# Altium schematic sheet FPGA Config_Power.SchDoc: =ProjectTitle
size A3; Author: Jaime I. Chait; Organization: NWES LLC; Address1: 111 SW 5th Ave, STE 3150; Address2: Portland, OR 97204; SheetNumber: 13; SheetTotal: 19
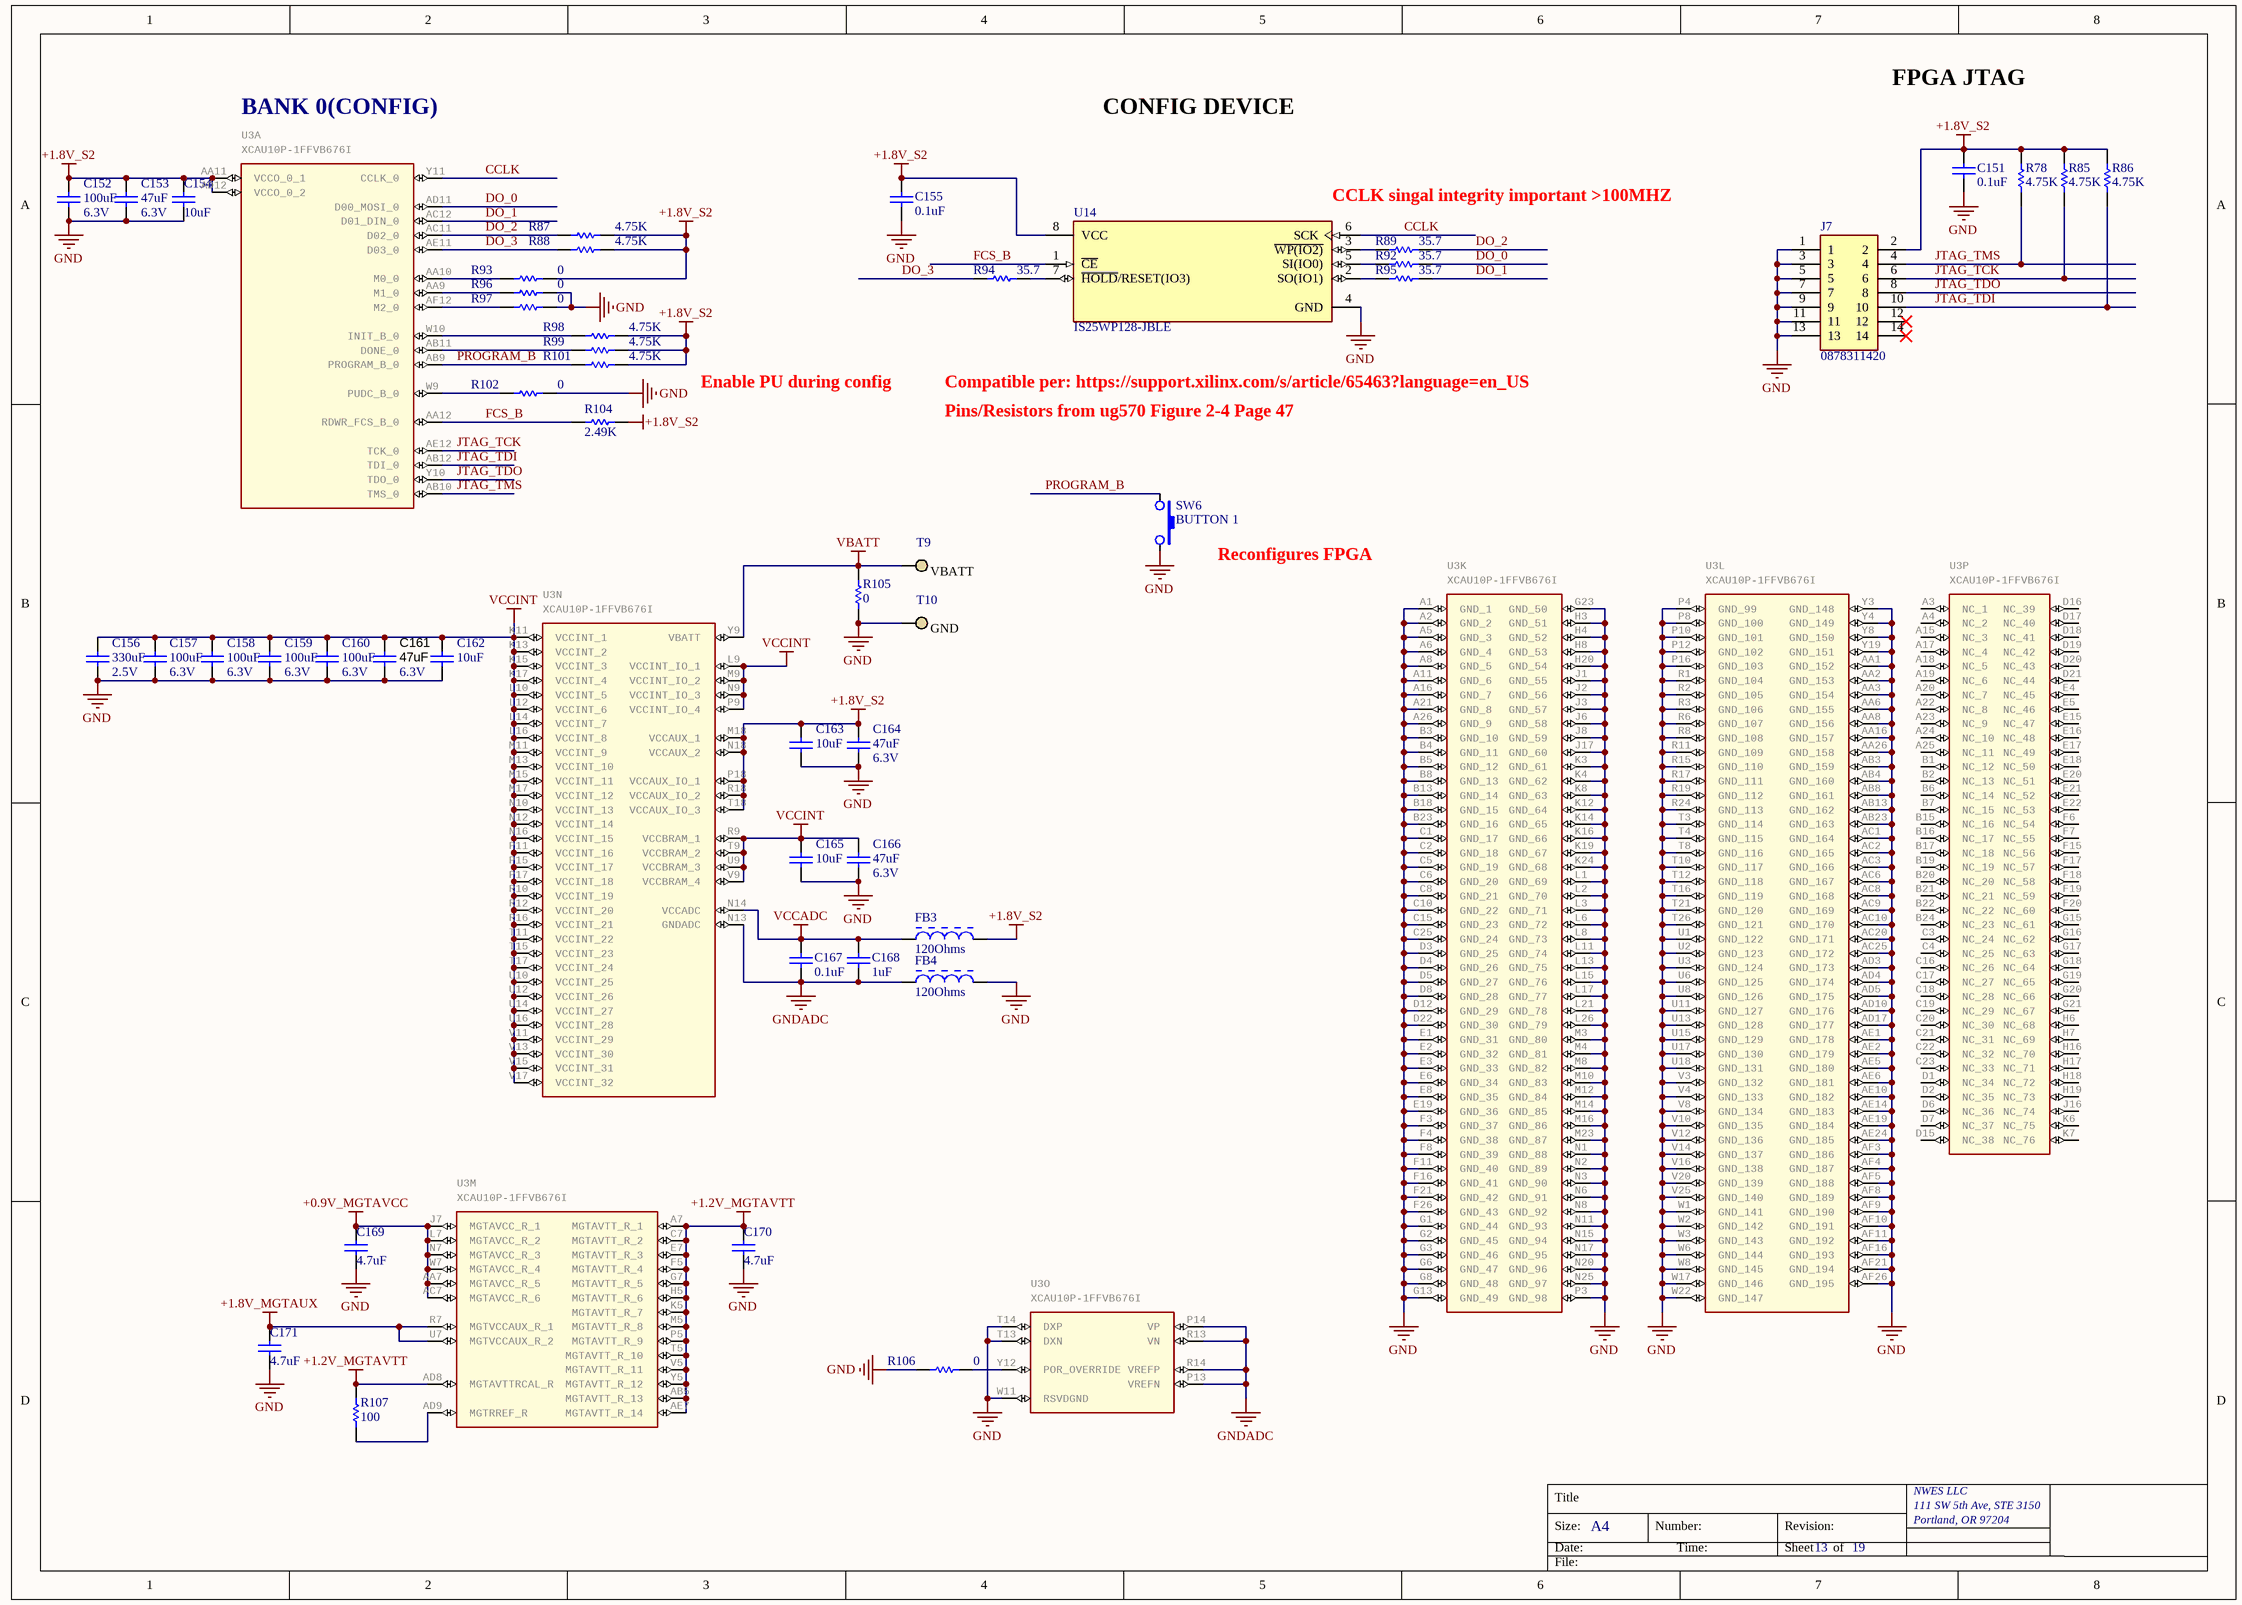
[diagram p0: FPGA Config_Power.SchDoc]

## Parts
C151  0.1uF  [CAPC1005X55USR]
C152  100uF  Voltage Rating: 6.3V  [CAPC2012X145USR]
C153  47uF  Voltage Rating: 6.3V  [CAPC2012X145USR]
C154  10uF  [CAPC1005X90]
C155  0.1uF  [CAPC1005X55USR]
C156  330uF  Voltage Rating: 2.5V  [CAPC3225X280N]
C157  100uF  Voltage Rating: 6.3V  [CAPC2012X145USR]
C158  100uF  Voltage Rating: 6.3V  [CAPC2012X145USR]
C159  100uF  Voltage Rating: 6.3V  [CAPC2012X145USR]
C160  100uF  Voltage Rating: 6.3V  [CAPC2012X145USR]
C161  47uF  Voltage Rating: 6.3V  [CAPC1608X100N]
C162  10uF  [CAPC1005X90]
C163  10uF  [CAPC1005X90]
C164  47uF  Voltage Rating: 6.3V  [CAPC2012X145USR]
C165  10uF  [CAPC1005X90]
C166  47uF  Voltage Rating: 6.3V  [CAPC2012X145USR]
C167  0.1uF  [CAPC1005X55USR]
C168  1uF  [CAPC1005X55USR]
C169  4.7uF  [CAPC1005X65USR]
C170  4.7uF  [CAPC1005X65USR]
C171  4.7uF  [CAPC1005X65USR]
FB3  120Ohms  [0402_FB]
FB4  120Ohms  [0402_FB]
J7  0878311420  [Molex_0878311420]
R78  4.75K  [RESC1005X40USR]
R85  4.75K  [RESC1005X40USR]
R86  4.75K  [RESC1005X40USR]
R87  4.75K  [RESC1005X40USR]
R88  4.75K  [RESC1005X40USR]
R89  35.7  [RESC1005X40USR]
R92  35.7  [RESC1005X40USR]
R93  0  [RESC1005X40USR]
R94  35.7  [RESC1005X40USR]
R95  35.7  [RESC1005X40USR]
R96  0  [RESC1005X40USR]
R97  0  [RESC1005X40USR]
R98  4.75K  [RESC1005X40USR]
R99  4.75K  [RESC1005X40USR]
R101  4.75K  [RESC1005X40USR]
R102  0  [RESC1005X40USR]
R104  2.49K  [RESC1005X40USR]
R105  0  [RESC1005X40USR]
R106  0  [RESC1005X40USR]
R107  100  [RESC1005X40USR]
SW6  BUTTON 1  [PTS820J25MSMTRLFS]
T9  Parameter 1: VBATT  [TP_SM_1MM]  (hidden comment: TP_S)  (no BOM)
T10  Parameter 1: GND  [TP_SM_1MM]  (hidden comment: TP_S)  (no BOM)
U3  XCAU10P-1FFVB676I  [676-FCBGA (27x27)]  (parts A,K,L,M,N,O,P of 16)
U14  IS25WP128-JBLE  [SOIC8_5.3mm_W]

## Nets
+0.9V_MGTAVCC: C169.2 U3.AA7(MGTAVCC_R_5) U3.AC7(MGTAVCC_R_6) U3.J7(MGTAVCC_R_1) U3.L7(MGTAVCC_R_2) U3.N7(MGTAVCC_R_3) U3.W7(MGTAVCC_R_4)
+1.2V_MGTAVTT: C170.2 R107.2 U3.A7(MGTAVTT_R_1) U3.AB5(MGTAVTT_R_13) U3.AD8(MGTAVTTRCAL_R) U3.AE7(MGTAVTT_R_14) U3.C7(MGTAVTT_R_2) U3.E7(MGTAVTT_R_3) U3.F5(MGTAVTT_R_4) U3.G7(MGTAVTT_R_5) U3.H5(MGTAVTT_R_6) U3.K5(MGTAVTT_R_7) U3.M5(MGTAVTT_R_8) U3.P5(MGTAVTT_R_9) U3.T5(MGTAVTT_R_10) U3.V5(MGTAVTT_R_11) U3.Y5(MGTAVTT_R_12)
+1.8V_MGTAUX: C171.2 U3.R7(MGTVCCAUX_R_1) U3.U7(MGTVCCAUX_R_2)
+1.8V_S2: C151.2 C152.1 C153.1 C154.2 C155.2 C163.2 C164.1 FB3.2 J7.2 R78.2 R85.2 R86.2 R87.1 R88.1 R93.2 R98.1 R99.1 R101.1 R104.1 U3.AA11(VCCO_0_1) U3.AD12(VCCO_0_2) U3.M18(VCCAUX_1) U3.N18(VCCAUX_2) U3.P18(VCCAUX_IO_1) U3.R18(VCCAUX_IO_2) U3.T18(VCCAUX_IO_3) U14.8(VCC)
GND: C151.1 C152.2 C153.2 C154.1 C155.1 C156.2 C157.2 C158.2 C159.2 C160.2 C161.2 C162.1 C163.1 C164.2 C165.1 C166.2 C169.1 C170.1 C171.1 FB4.2 J7.1 J7.3 J7.5 J7.7 J7.9 J7.11 J7.13 R96.2 R97.2 R102.2 R105.1 R106.1 SW6.2 T10.1 U3.A1(GND_1) U3.A2(GND_2) U3.A5(GND_3) U3.A6(GND_4) U3.A8(GND_5) U3.A11(GND_6) U3.A16(GND_7) U3.A21(GND_8) U3.A26(GND_9) U3.AA1(GND_152) U3.AA2(GND_153) U3.AA3(GND_154) U3.AA6(GND_155) U3.AA8(GND_156) U3.AA16(GND_157) U3.AA26(GND_158) U3.AB3(GND_159) U3.AB4(GND_160) U3.AB8(GND_161) U3.AB13(GND_162) U3.AB23(GND_163) U3.AC1(GND_164) U3.AC2(GND_165) U3.AC3(GND_166) U3.AC6(GND_167) U3.AC8(GND_168) U3.AC9(GND_169) U3.AC10(GND_170) U3.AC20(GND_171) U3.AC25(GND_172) U3.AD3(GND_173) U3.AD4(GND_174) U3.AD5(GND_175) U3.AD10(GND_176) U3.AD17(GND_177) U3.AE1(GND_178) U3.AE2(GND_179) U3.AE5(GND_180) U3.AE6(GND_181) U3.AE10(GND_182) U3.AE14(GND_183) U3.AE19(GND_184) U3.AE24(GND_185) U3.AF3(GND_186) U3.AF4(GND_187) U3.AF5(GND_188) U3.AF8(GND_189) U3.AF9(GND_190) U3.AF10(GND_191) U3.AF11(GND_192) U3.AF16(GND_193) U3.AF21(GND_194) U3.AF26(GND_195) U3.B3(GND_10) U3.B4(GND_11) U3.B5(GND_12) U3.B8(GND_13) U3.B13(GND_14) U3.B18(GND_15) U3.B23(GND_16) U3.C1(GND_17) U3.C2(GND_18) U3.C5(GND_19) U3.C6(GND_20) U3.C8(GND_21) U3.C10(GND_22) U3.C15(GND_23) U3.C25(GND_24) U3.D3(GND_25) U3.D4(GND_26) U3.D5(GND_27) U3.D8(GND_28) U3.D12(GND_29) U3.D22(GND_30) U3.E1(GND_31) U3.E2(GND_32) U3.E3(GND_33) U3.E6(GND_34) U3.E8(GND_35) U3.E19(GND_36) U3.F3(GND_37) U3.F4(GND_38) U3.F8(GND_39) U3.F11(GND_40) U3.F16(GND_41) U3.F21(GND_42) U3.F26(GND_43) U3.G1(GND_44) U3.G2(GND_45) U3.G3(GND_46) U3.G6(GND_47) U3.G8(GND_48) U3.G13(GND_49) U3.G23(GND_50) U3.H3(GND_51) U3.H4(GND_52) U3.H8(GND_53) U3.H20(GND_54) U3.J1(GND_55) U3.J2(GND_56) U3.J3(GND_57) U3.J6(GND_58) U3.J8(GND_59) U3.J17(GND_60) U3.K3(GND_61) U3.K4(GND_62) U3.K8(GND_63) U3.K12(GND_64) U3.K14(GND_65) U3.K16(GND_66) U3.K19(GND_67) U3.K24(GND_68) U3.L1(GND_69) U3.L2(GND_70) U3.L3(GND_71) U3.L6(GND_72) U3.L8(GND_73) U3.L11(GND_74) U3.L13(GND_75) U3.L15(GND_76) U3.L17(GND_77) U3.L21(GND_78) U3.L26(GND_79) U3.M3(GND_80) U3.M4(GND_81) U3.M8(GND_82) U3.M10(GND_83) U3.M12(GND_84) U3.M14(GND_85) U3.M16(GND_86) U3.M23(GND_87) U3.N1(GND_88) U3.N2(GND_89) U3.N3(GND_90) U3.N6(GND_91) U3.N8(GND_92) U3.N11(GND_93) U3.N15(GND_94) U3.N17(GND_95) U3.N20(GND_96) U3.N25(GND_97) U3.P3(GND_98) U3.P4(GND_99) U3.P8(GND_100) U3.P10(GND_101) U3.P12(GND_102) U3.P16(GND_103) U3.R1(GND_104) U3.R2(GND_105) U3.R3(GND_106) U3.R6(GND_107) U3.R8(GND_108) U3.R11(GND_109) U3.R15(GND_110) U3.R17(GND_111) U3.R19(GND_112) U3.R24(GND_113) U3.T3(GND_114) U3.T4(GND_115) U3.T8(GND_116) U3.T10(GND_117) U3.T12(GND_118) U3.T13(DXN) U3.T14(DXP) U3.T16(GND_119) U3.T21(GND_120) U3.T26(GND_121) U3.U1(GND_122) U3.U2(GND_123) U3.U3(GND_124) U3.U6(GND_125) U3.U8(GND_126) U3.U11(GND_127) U3.U13(GND_128) U3.U15(GND_129) U3.U17(GND_130) U3.U18(GND_131) U3.V3(GND_132) U3.V4(GND_133) U3.V8(GND_134) U3.V10(GND_135) U3.V12(GND_136) U3.V14(GND_137) U3.V16(GND_138) U3.V20(GND_139) U3.V25(GND_140) U3.W1(GND_141) U3.W2(GND_142) U3.W3(GND_143) U3.W6(GND_144) U3.W8(GND_145) U3.W11(RSVDGND) U3.W17(GND_146) U3.W22(GND_147) U3.Y3(GND_148) U3.Y4(GND_149) U3.Y8(GND_150) U3.Y19(GND_151) U14.4(GND)
GNDADC: C167.1 C168.1 FB4.1 U3.N13(GNDADC) U3.P13(VREFN) U3.P14(VP) U3.R13(VN) U3.R14(VREFP)
VBATT: R105.2 T9.1 U3.Y9(VBATT)
VCCADC: C167.2 C168.2 FB3.1 U3.N14(VCCADC)
VCCINT: C156.1 C157.1 C158.1 C159.1 C160.1 C161.1 C162.2 C165.2 C166.1 U3.K11(VCCINT_1) U3.K13(VCCINT_2) U3.K15(VCCINT_3) U3.K17(VCCINT_4) U3.L9(VCCINT_IO_1) U3.L10(VCCINT_5) U3.L12(VCCINT_6) U3.L14(VCCINT_7) U3.L16(VCCINT_8) U3.M9(VCCINT_IO_2) U3.M11(VCCINT_9) U3.M13(VCCINT_10) U3.M15(VCCINT_11) U3.M17(VCCINT_12) U3.N9(VCCINT_IO_3) U3.N10(VCCINT_13) U3.N12(VCCINT_14) U3.N16(VCCINT_15) U3.P9(VCCINT_IO_4) U3.P11(VCCINT_16) U3.P15(VCCINT_17) U3.P17(VCCINT_18) U3.R9(VCCBRAM_1) U3.R10(VCCINT_19) U3.R12(VCCINT_20) U3.R16(VCCINT_21) U3.T9(VCCBRAM_2) U3.T11(VCCINT_22) U3.T15(VCCINT_23) U3.T17(VCCINT_24) U3.U9(VCCBRAM_3) U3.U10(VCCINT_25) U3.U12(VCCINT_26) U3.U14(VCCINT_27) U3.U16(VCCINT_28) U3.V9(VCCBRAM_4) U3.V11(VCCINT_29) U3.V13(VCCINT_30) U3.V15(VCCINT_31) U3.V17(VCCINT_32)
CCLK: U3.Y11(CCLK_0) U14.6(SCK)
DO_0: R92.1 U3.AD11(D00_MOSI_0)
DO_1: R95.1 U3.AC12(D01_DIN_0)
DO_2: R87.2 R89.1 U3.AC11(D02_0)
DO_3: R88.2 R94.2 U3.AE11(D03_0)
FCS_B: R104.2 U3.AA12(RDWR_FCS_B_0) U14.1(~{CE})
JTAG_TCK: J7.6 R85.1 U3.AE12(TCK_0)
JTAG_TDI: J7.10 R86.1 U3.AB12(TDI_0)
JTAG_TDO: J7.8 U3.Y10(TDO_0)
JTAG_TMS: J7.4 R78.1 U3.AB10(TMS_0)
PROGRAM_B: R101.2 SW6.1 U3.AB9(PROGRAM_B_0)
NetR89_2: R89.2 U14.3(~{WP(IO2)})
NetR92_2: R92.2 U14.5(SI(IO0))
NetR93_1: R93.1 U3.AA10(M0_0)
NetR94_1: R94.1 U14.7(~{HOLD}/RESET(IO3))
NetR95_2: R95.2 U14.2(SO(IO1))
NetR96_1: R96.1 U3.AA9(M1_0)
NetR97_1: R97.1 U3.AF12(M2_0)
NetR98_2: R98.2 U3.W10(INIT_B_0)
NetR99_2: R99.2 U3.AB11(DONE_0)
NetR102_1: R102.1 U3.W9(PUDC_B_0)
NetR106_2: R106.2 U3.Y12(POR_OVERRIDE)
NetR107_1: R107.1 U3.AD9(MGTRREF_R)

Not connected (* = marked no-connect by the designer): J7 12* 14*; U3 A3(NC_1) A4(NC_2) A15(NC_3) A17(NC_4) A18(NC_5) A19(NC_6) A20(NC_7) A22(NC_8) A23(NC_9) A24(NC_10) A25(NC_11) B1(NC_12) B2(NC_13) B6(NC_14) B7(NC_15) B15(NC_16) B16(NC_17) B17(NC_18) B19(NC_19) B20(NC_20) B21(NC_21) B22(NC_22) B24(NC_23) C3(NC_24) C4(NC_25) C16(NC_26) C17(NC_27) C18(NC_28) C19(NC_29) C20(NC_30) C21(NC_31) C22(NC_32) C23(NC_33) D1(NC_34) D2(NC_35) D6(NC_36) D7(NC_37) D15(NC_38) D16(NC_39) D17(NC_40) D18(NC_41) D19(NC_42) D20(NC_43) D21(NC_44) E4(NC_45) E5(NC_46) E15(NC_47) E16(NC_48) E17(NC_49) E18(NC_50) E20(NC_51) E21(NC_52) E22(NC_53) F6(NC_54) F7(NC_55) F15(NC_56) F17(NC_57) F18(NC_58) F19(NC_59) F20(NC_60) G15(NC_61) G16(NC_62) G17(NC_63) G18(NC_64) G19(NC_65) G20(NC_66) G21(NC_67) H6(NC_68) H7(NC_69) H16(NC_70) H17(NC_71) H18(NC_72) H19(NC_73) J16(NC_74) K6(NC_75) K7(NC_76)

## Notes on the sheet
- CONFIG DEVICE
- FPGA JTAG
- CCLK singal integrity important >100MHZ
- Enable PU during config
- Compatible per: https://support.xilinx.com/s/article/65463?language=en_US
- Pins/Resistors from ug570 Figure 2-4 Page 47
- Reconfigures FPGA
- Title
- Size:
- Date:
- A4
- Number:
- Time:
- Revision:
- Sheet
- of
- File:
- (in symbol XCAU10P-1FFVB676I, part A) BANK 0(CONFIG)

## Library data of the parts
C151 C155 C167 = CAP CER 0.1UF 25V X5R 0402: Manufacturer Part Number: CL05A104KA5NNNC; Manufacturer: Samsung Electro-Mechanics; Supplier Part Number 1: 1276-1043-1-ND; Package: 0402; Height: 0.55mm; Supplier 1: Digi-Key; value: 0.1uF
C152 C157-C160 = CAP CER 100UF 6.3V X5R 0805: 0805 100 uF 6.3 V ±20% Tolerance X5R Multilayer Ceramic Chip Capacitor; Manufacturer: Murata; Manufacturer Part Number: GRM21BR60J107ME15L; Supplier 1: Digi-Key; RoHS: Yes; Category: Ceramic Capacitors; Stock 1: 780070; Pricing 1: 3000=0.42426, 6000=0.40911, 9000=0.39395, 15000=0.38638 (USD); Mount: Surface Mount; Case/Package: 0805; Case Code (Metric): 2012; Case Code (Imperial): 0805; Min Operating Temperature: -55°C; Max Operating Temperature: 85°C; Packaging: Cut Tape; Dielectric: X5R; Tolerance: 20%; Voltage Rating (DC): 6.3V; Capacitance: 100uF; Series: GRM; Length: 0.079inch; Width: 0.049inch; Thickness: 0.057inch; Reach SVHC Compliant: Yes; Lead Free: Lead Free; RoHS Compliant: Yes; ComponentLink1URL: http://www.farnell.com/datasheets/1957830.pdf?src-supplier=Farnell; ComponentLink1Description: http://www.farnell.com/datasheets/1957830.pdf?src-supplier=Farnell; ComponentLink2URL: http://www.farnell.com/datasheets/1957830.pdf?src-supplier=Element14; ComponentLink2Description: http://www.farnell.com/datasheets/1957830.pdf?src-supplier=Element14; ComponentLink3URL: https://search.murata.co.jp/Ceramy/image/img/A01X/G101/ENG/GRM21BR60J107ME15-01.pdf?src-supplier=Digi-Key; ComponentLink3Description: https://search.murata.co.jp/Ceramy/image/img/A01X/G101/ENG/GRM21BR60J107ME15-01.pdf?src-supplier=Digi-Key; ComponentLink4URL: http://www.farnell.com/datasheets/1957830.pdf?src-supplier=Newark; ComponentLink4Description: http://www.farnell.com/datasheets/1957830.pdf?src-supplier=Newark; Supplier Part Number 1: 490-13981-2-ND
C153 C164 C166 = CAP CER 47UF 6.3V X5R 0805: Manufacturer: Samsung; Manufacturer Part Number: CL21A476MQYNNNE; Tolerance: 20%; Supplier 1: Digi-Key; RoHS: Yes; Category: Ceramic Capacitors; Stock 1: 1673694; Pricing 1: 1=0.29000, 10=0.20200, 50=0.13440, 100=0.11420, 500=0.08064, 1000=0.07057 (USD); Mount: Surface Mount; Case/Package: 0805; Case Code (Metric): 2012; Case Code (Imperial): 0805; Contact Plating: Tin; Min Operating Temperature: -55°C; Max Operating Temperature: 85°C; Capacitance: 47uF; Package Quantity: 1; Packaging: Tape and Reel; Dielectric: X5R; Series: CL; Construction: Flat; Length: 2mm; Width: 0.049inch; Height: 1.25mm; Thickness: 0.057inch; Depth: 1.25mm; Radiation Hardening: No; RoHS Compliant: Yes; ComponentLink1URL: https://datasheet.ciiva.com/25791/cl21a476mqynnne-25791153.pdf?src-supplier=Digi-Key; ComponentLink1Description: https://datasheet.ciiva.com/25791/cl21a476mqynnne-25791153.pdf?src-supplier=Digi-Key; ComponentLink2URL: https://datasheet.ciiva.com/26838/getdatasheetpartid-359050-26838632.pdf?src-supplier=Verical; ComponentLink2Description: https://datasheet.ciiva.com/26838/getdatasheetpartid-359050-26838632.pdf?src-supplier=Verical; Supplier Part Number 1: 1276-1852-1-ND
C154 C162 C163 C165 = CAP CER 10UF 10V X5R 0402: Manufacturer Part Number: CL05A106MP8NUB8; Manufacturer: Samsung Electro-Mechanics; Part #: E-CAP-042; Supplier Part Number 1: 1276-6830-2-ND; Package: 0402; value: 10uF; Supplier 1: Digi-Key; Height: 0.9mm; ComponentLink1Description: New link; ComponentLink1URL: *
C156 = CAP CER 330UF 2.5V X6S 1210: 1210 2.5V X6S 330uF 20% multilayer ceramic capacitor; Manufacturer: Murata; Manufacturer Part Number: GRM32EC80E337ME05L; Supplier 1: Digi-Key; RoHS: Yes; Category: Ceramic Capacitors; Stock 1: 66804; Pricing 1: 1=1.88000, 10=1.48300, 50=1.28540, 100=1.11240, 500=0.84050 (USD); Mount: Surface Mount; Case/Package: 1210; Case Code (Metric): 3225; Case Code (Imperial): 1210; Min Operating Temperature: -55°C; Max Operating Temperature: 105°C; Packaging: Tape and Reel; Capacitance: 330uF; Tolerance: 20%; Voltage Rating (DC): 2.5V; Dielectric: X6S; Length: 0.126inch; Width: 0.098inch; Thickness: 0.11inch; RoHS Compliant: Yes; ComponentLink1URL: http://www.farnell.com/datasheets/2867880.pdf?src-supplier=Farnell; ComponentLink1Description: http://www.farnell.com/datasheets/2867880.pdf?src-supplier=Farnell; ComponentLink2URL: http://search.murata.co.jp/Ceramy/image/img/A01X/partnumbering_e_01.pdf?src-supplier=Digi-Key; ComponentLink2Description: http://search.murata.co.jp/Ceramy/image/img/A01X/partnumbering_e_01.pdf?src-supplier=Digi-Key; ComponentLink3URL: http://search.murata.co.jp/Ceramy/image/img/A01X/G101/ENG/GRM32EC80E337ME05-01.pdf?src-supplier=Digi-Key; ComponentLink3Description: http://search.murata.co.jp/Ceramy/image/img/A01X/G101/ENG/GRM32EC80E337ME05-01.pdf?src-supplier=Digi-Key; ComponentLink4URL: http://www.farnell.com/datasheets/2165382.pdf?src-supplier=Newark; ComponentLink4Description: http://www.farnell.com/datasheets/2165382.pdf?src-supplier=Newark; Supplier Part Number 1: 490-13972-1-ND
C161 = CAP CER 47UF 6.3V X5R 0603: 0603 6.3 V 47 uF ±20% Tolerance X5R SMT Multilayer Ceramic Chp Capacitor; Manufacturer: Murata; Manufacturer Part Number: GRM188R60J476ME15D; Supplier 1: Digi-Key; RoHS: Yes; Category: Ceramic Capacitors; Stock 1: 865472; Pricing 1: 1=0.45000, 10=0.31900, 50=0.24120, 100=0.21000, 500=0.15556, 1000=0.13223 (USD); Mount: Surface Mount; Case/Package: 0603; Case Code (Metric): 1608; Case Code (Imperial): 0603; Min Operating Temperature: -55°C; Max Operating Temperature: 85°C; Capacitance: 47uF; Tolerance: 20%; Packaging: Tape and Reel; Dielectric: X5R; Length: 0.063inch; Width: 0.031inch; Thickness: 0.039inch; RoHS Compliant: Yes; ComponentLink1URL: http://search.murata.co.jp/Ceramy/image/img/A01X/G101/ENG/GRM188R60J476ME15-01.pdf?src-supplier=Digi-Key; ComponentLink1Description: http://search.murata.co.jp/Ceramy/image/img/A01X/G101/ENG/GRM188R60J476ME15-01.pdf?src-supplier=Digi-Key; ComponentLink2URL: https://www.murata.com/~/media/webrenewal/support/library/catalog/products/capacitor/mlcc/c02e.ashx?la=en-us&src-supplier=Digi-Key; ComponentLink2Description: https://www.murata.com/~/media/webrenewal/support/library/catalog/products/capacitor/mlcc/c02e.ashx?la=en-us&src-supplier=Digi-Key; Supplier Part Number 1: 490-13247-1-ND; Voltage Rating (DC): 6.3V
C168 = CAP CER 1UF 25V X5R 0402: Manufacturer Part Number: GRM155R61E105MA12D; Manufacturer: Murata Electronics; Part #: E-CAP-042; Supplier Part Number 1: 490-10018-1-ND; Package: 0402; value: 1uF; Supplier 1: Digi-Key; Height: 0.55mm; ComponentLink1Description: New link; ComponentLink1URL: *
C169-C171 = CAP CER 4.7UF 10V X5R 0402: Manufacturer Part Number: C1005X5R1A475M050BC; Manufacturer: TDK Corporation; Package: 0402; Supplier Part Number 1: 445-8023-1-ND; Value: 4.7uF; Supplier 1: Digi-Key
FB3 FB4 = FERRITE BEAD 120 OHM 0402 1LN: Manufacturer Part Number: BLM15AG121SN1D; Manufacturer: Murata Electronics; Supplier Part Number 1: 490-1005-2-ND; Package: 0402; Value: 120Ohms; Supplier 1: Digi-Key; Height: 0.55mm; ComponentLink1Description: New link; ComponentLink1URL: *
J7 = HEADER VERT 2X7 2MM: 2.00mm Pitch Milli-Grid Header Vertical Through Hole Shrouded 14 Circuits 0.38; Manufacturer: Molex; Manufacturer Part Number: 87831-1420; Current Rating: 2A; Voltage Rating: 125V; Number of Positions: 14; Gender: Male; Insulation Resistance: 1GR; Shrouded: Yes (With); Pitch: 2mm; Glow Wire Compliant: Non-compliant; Supplier 1: Digi-Key; RoHS: Yes; Category: Headers and Wire Housings; Stock 1: 29512; Pricing 1: 1=2.58000, 10=2.19800, 100=1.81590, 1000=1.43364, 5000=1.27116 (USD); Mount: Through Hole; Contact Plating: Gold; Contact Material: Brass,Bronze,Gold; Color: Black; Housing Color: Black; Housing Material: Thermoplastic; Min Operating Temperature: -55°C; Max Operating Temperature: 105°C; Number of Rows: 2; Package Quantity: 3200; Packaging: Rail/Tube; Termination: Solder; Number of Contacts: 14; Orientation: Vertical; Number of Circuits: 14; Voltage Rating (DC): 125V; Series: Milli-Grid; Lead Pitch: 2mm; Radiation Hardening: No; Reach SVHC Compliant: Yes; Lead Free: Lead Free; Flammability Rating: UL94 V-0; RoHS Compliant: Yes; ComponentLink1URL: https://datasheet.ciiva.com/27096/1934585-27096088.pdf?src-supplier=Jameco; ComponentLink1Description: https://datasheet.ciiva.com/27096/1934585-27096088.pdf?src-supplier=Jameco; ComponentLink2URL: https://datasheet.ciiva.com/30081/113380878311420-pcb-headers-30081880.pdf?src-supplier=Onlinecomponents.com; ComponentLink2Description: https://datasheet.ciiva.com/30081/113380878311420-pcb-headers-30081880.pdf?src-supplier=Onlinecomponents.com; ComponentLink3URL: https://datasheet.ciiva.com/5150/0878311420-pcb-headers-176448-5150987.pdf?src-supplier=Mouser; ComponentLink3Description: https://datasheet.ciiva.com/5150/0878311420-pcb-headers-176448-5150987.pdf?src-supplier=Mouser; ComponentLink4URL: https://datasheet.ciiva.com/11746/0900766b80d68c18-11746337.pdf?src-supplier=RSComponents; ComponentLink4Description: https://datasheet.ciiva.com/11746/0900766b80d68c18-11746337.pdf?src-supplier=RSComponents; ComponentLink5URL: https://datasheet.ciiva.com/7814/1785393-7814919.pdf?src-supplier=Element14; ComponentLink5Description: https://datasheet.ciiva.com/7814/1785393-7814919.pdf?src-supplier=Element14; Supplier Part Number 1: WM17469-ND
R78 R85-R88 R98 R99 R101 = RES 4.75K OHM 1% 1/16W 0402: Manufacturer: YAGEO; Manufacturer Part Number: RC0402FR-074K75L; Supplier Part Number 1: 311-4.75KLCT-ND; Supplier 1: Digi-Key; Height: 0.4mm; Package: 0402; value: 4.75K
R89 R92 R94 R95 = RES 35.7 OHM 1% 1/16W 0402: Manufacturer: YAGEO; Manufacturer Part Number: RC0402FR-0735R7L; Supplier Part Number 1: YAG3131CT-ND; Supplier 1: Digi-Key; Height: 0.4mm; Package: 0402; value: 35.7
R93 R96 R97 R102 R105 R106 = RES 0 OHM JUMPER 1/16W 0402: Manufacturer: Yageo; Manufacturer Part Number: RC0402JR-070RL; Supplier Part Number 1: 311-0.0JRTR-ND; Package: 0402; Height: 0.4mm; Supplier 1: Digi-Key; value: 0
R104 = RES 2.49K OHM 1% 1/16W 0402: Manufacturer: YAGEO; Manufacturer Part Number: RC0402FR-072K49L; Supplier Part Number 1: 311-2.49KLRCT-ND; Supplier 1: Digi-Key; Height: 0.4mm; Package: 0402; value: 2.49K
R107 = RES 100 OHM 1% 1/16W 0402: Manufacturer: YAGEO; Manufacturer Part Number: RC0402FR-07100RL; Supplier Part Number 1: 311-100LRCT-ND; Supplier 1: Digi-Key; Height: 0.4mm; Package: 0402; value: 100
SW6 = SW_PTS820: C&K Series-PTS Tactile Switch PTS820 J25K SMTR LFS; Manufacturer: ITT C&K; Mechanical Life: 100000Cycles; Operating Force: 250gf; Throw Configuration: SPST; Current Rating: 50mA; Voltage Rating (DC): 12V; Illumination Type: Non-Illuminated; Switch Travel: 0.2mm; Switch Function: Off-Mom; Actuator Type: Standard; Supplier 1: Digi-Key; Manufacturer Part Number: PTS820J25KSMTRLFS; RoHS: Yes; Category: Tactile Switches; Stock 1: 37051; Pricing 1: 1=0.57000, 10=0.54600, 25=0.52560, 100=0.45500, 250=0.41456, 500=0.38424, 1000=0.34379 (USD); Mount: Surface Mount; Color: Black; Contact Plating: Silver; Min Operating Temperature: -40°C; Max Operating Temperature: 85°C; Packaging: Tape and Reel; Package Quantity: 2300; RoHS Compliant: Yes; ComponentLink1URL: https://datasheet.ciiva.com/24079/pts820-4mar13-248116-24079446.pdf?src-supplier=Mouser; ComponentLink1Description: https://datasheet.ciiva.com/24079/pts820-4mar13-248116-24079446.pdf?src-supplier=Mouser; Supplier Part Number 1: CKN10897CT-ND
T9 T10 = Test point PAD: test point
U3 = XCAU10P-1FFVB676I: IC FPGA ARTIXUP 676BGA; Manufacturer: AMD Xilinx; Manufacturer Part Number: XCAU10P-1FFVB676I; Supplier Part Number 1: 122-XCAU10P-1FFVB676I-ND; Supplier 1: Supplier
U14 = IS25WP128-JBLE: 128M QPI/QSPI, 8- SOP 208M , R HS, ET; Manufacturer: ISSI; Frequency: 133MHz; Address Bus Width: 24b; Density: 128Mb; Interface: SPI,Serial; Operating Supply Voltage: 1.8V; Memory Type: FLASH,NOR; Page Size: 256B; Max Operating Temperature: 105°C; Packaging: Rail/Tube; Min Operating Temperature: -40°C; Number of Pins: 8; RoHS Compliant: Yes; Case/Package: SOIC; Supplier 1: Digi-Key; Manufacturer Part Number: IS25WP128-JBLE; RoHS: Yes; Category: Flash; Stock 1: 30572; Pricing 1: 1=2.63000, 10=2.36700, 25=2.33080, 50=2.32460, 100=2.07720, 250=2.00892, 500=2.00160, 1000=1.86385, 5000=1.72500 (USD); ComponentLink1URL: http://www.mouser.com/ds/2/198/IS25WP032-064-128-737458.pdf?src-supplier=Mouser; ComponentLink1Description: http://www.mouser.com/ds/2/198/IS25WP032-064-128-737458.pdf?src-supplier=Mouser; ComponentLink2URL: http://www.issi.com/WW/pdf/IS25WP032-064-128.pdf?src-supplier=Avnet; ComponentLink2Description: http://www.issi.com/WW/pdf/IS25WP032-064-128.pdf?src-supplier=Avnet; ComponentLink3URL: http://www.issi.com/WW/pdf/IS25WP032-064-128.pdf?src-supplier=Digi-Key; ComponentLink3Description: http://www.issi.com/WW/pdf/IS25WP032-064-128.pdf?src-supplier=Digi-Key; Supplier Part Number 1: 706-1443-ND